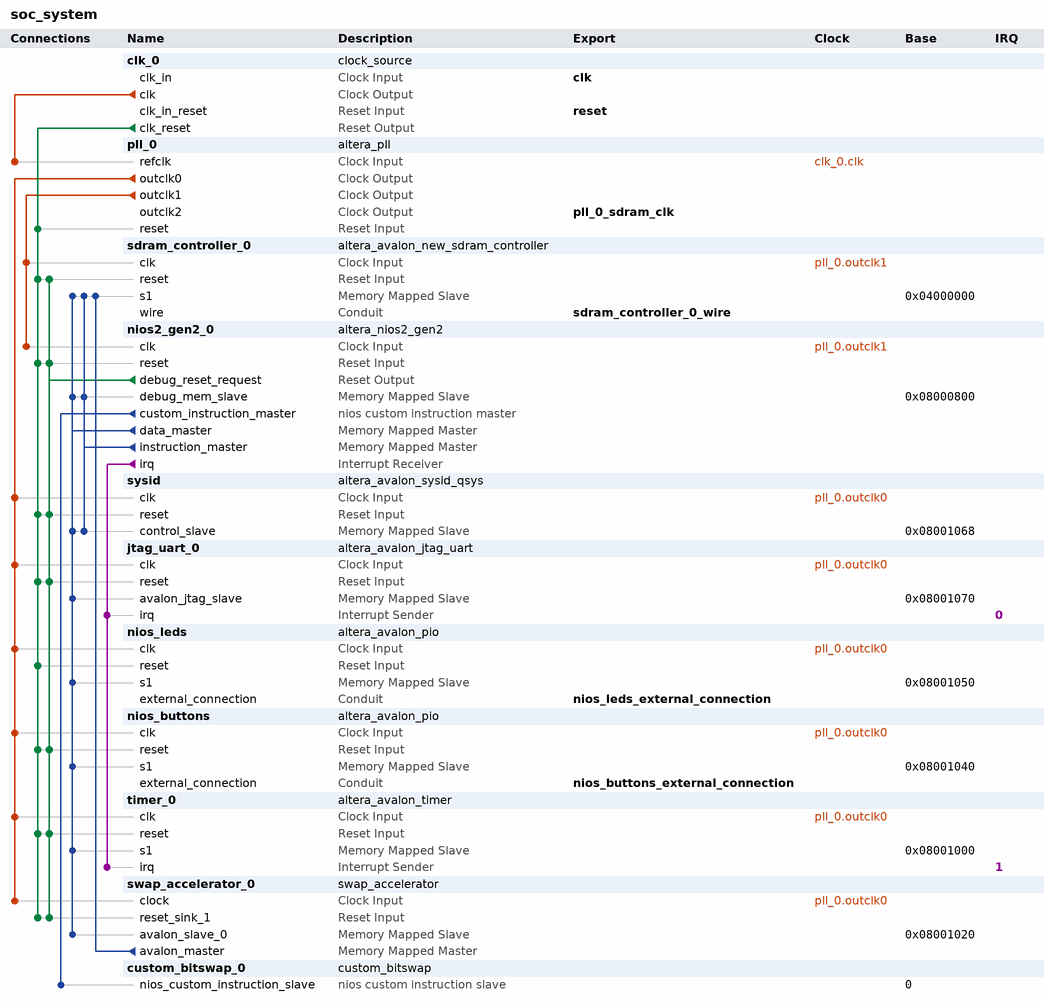
[diagram p0: system contents]
# Platform Designer (Qsys) system soc_system, Cyclone V 5CSEMA5F31C6
# Parameters at their usual value, and those the tool derives, are not listed.
package require -exact qsys 18.1
create_system soc_system
set_project_property DEVICE_FAMILY {Cyclone V}
set_project_property DEVICE 5CSEMA5F31C6

add_instance clk_0 clock_source 18.1
set_instance_parameter_value clk_0 clockFrequency 50000000

add_instance pll_0 altera_pll 18.1
set_instance_parameter_value pll_0 gui_device_speed_grade 1
set_instance_parameter_value pll_0 gui_number_of_clocks 4
set_instance_parameter_value pll_0 gui_operation_mode normal
set_instance_parameter_value pll_0 gui_output_clock_frequency0 50.0
set_instance_parameter_value pll_0 gui_output_clock_frequency1 100.0
set_instance_parameter_value pll_0 gui_output_clock_frequency2 100.0
set_instance_parameter_value pll_0 gui_output_clock_frequency3 300.0
set_instance_parameter_value pll_0 gui_phase_shift2 -3750
set_instance_parameter_value pll_0 gui_pll_mode {Integer-N PLL}
set_instance_parameter_value pll_0 gui_reference_clock_frequency 50.0
set_instance_parameter_value pll_0 gui_use_locked false

add_instance sdram_controller_0 altera_avalon_new_sdram_controller 18.1
set_instance_parameter_value sdram_controller_0 TAC 5.4
set_instance_parameter_value sdram_controller_0 TRCD 15.0
set_instance_parameter_value sdram_controller_0 TRP 15.0
set_instance_parameter_value sdram_controller_0 casLatency 3
set_instance_parameter_value sdram_controller_0 columnWidth 10
set_instance_parameter_value sdram_controller_0 dataWidth 16
set_instance_parameter_value sdram_controller_0 generateSimulationModel false
set_instance_parameter_value sdram_controller_0 model single_Micron_MT48LC4M32B2_7_chip
set_instance_parameter_value sdram_controller_0 numberOfBanks 4
set_instance_parameter_value sdram_controller_0 numberOfChipSelects 1
set_instance_parameter_value sdram_controller_0 powerUpDelay 100.0
set_instance_parameter_value sdram_controller_0 refreshPeriod 7.8125
set_instance_parameter_value sdram_controller_0 rowWidth 13

add_instance nios2_gen2_0 altera_nios2_gen2 18.1
set_instance_parameter_value nios2_gen2_0 dcache_size 2048
set_instance_parameter_value nios2_gen2_0 exceptionSlave sdram_controller_0.s1
set_instance_parameter_value nios2_gen2_0 icache_burstType Sequential
set_instance_parameter_value nios2_gen2_0 icache_size 4096
set_instance_parameter_value nios2_gen2_0 impl Fast
set_instance_parameter_value nios2_gen2_0 resetSlave sdram_controller_0.s1

add_instance sysid altera_avalon_sysid_qsys 18.1
set_instance_parameter_value sysid id 0

add_instance jtag_uart_0 altera_avalon_jtag_uart 18.1
set_instance_parameter_value jtag_uart_0 simInteractiveOptions NO_INTERACTIVE_WINDOWS

add_instance nios_leds altera_avalon_pio 18.1
set_instance_parameter_value nios_leds direction Output
set_instance_parameter_value nios_leds width 10

add_instance nios_buttons altera_avalon_pio 18.1
set_instance_parameter_value nios_buttons direction Input
set_instance_parameter_value nios_buttons width 3

add_instance timer_0 altera_avalon_timer 18.1
set_instance_parameter_value timer_0 period 1000
set_instance_parameter_value timer_0 periodUnits MSEC

add_instance swap_accelerator_0 swap_accelerator 1.0

add_instance custom_bitswap_0 custom_bitswap 1.0

# connections
add_connection clk_0.clk pll_0.refclk clock
add_connection pll_0.outclk0 jtag_uart_0.clk clock
add_connection pll_0.outclk0 nios_buttons.clk clock
add_connection pll_0.outclk0 nios_leds.clk clock
add_connection pll_0.outclk0 swap_accelerator_0.clock clock
add_connection pll_0.outclk0 sysid.clk clock
add_connection pll_0.outclk0 timer_0.clk clock
add_connection pll_0.outclk1 nios2_gen2_0.clk clock
add_connection pll_0.outclk1 sdram_controller_0.clk clock
add_connection clk_0.clk_reset jtag_uart_0.reset reset
add_connection clk_0.clk_reset nios2_gen2_0.reset reset
add_connection clk_0.clk_reset nios_buttons.reset reset
add_connection clk_0.clk_reset nios_leds.reset reset
add_connection clk_0.clk_reset pll_0.reset reset
add_connection clk_0.clk_reset sdram_controller_0.reset reset
add_connection clk_0.clk_reset swap_accelerator_0.reset_sink_1 reset
add_connection clk_0.clk_reset sysid.reset reset
add_connection clk_0.clk_reset timer_0.reset reset
add_connection nios2_gen2_0.debug_reset_request jtag_uart_0.reset reset
add_connection nios2_gen2_0.debug_reset_request nios2_gen2_0.reset reset
add_connection nios2_gen2_0.debug_reset_request nios_buttons.reset reset
add_connection nios2_gen2_0.debug_reset_request sdram_controller_0.reset reset
add_connection nios2_gen2_0.debug_reset_request swap_accelerator_0.reset_sink_1 reset
add_connection nios2_gen2_0.debug_reset_request sysid.reset reset
add_connection nios2_gen2_0.debug_reset_request timer_0.reset reset
add_connection nios2_gen2_0.data_master jtag_uart_0.avalon_jtag_slave avalon
set_connection_parameter_value nios2_gen2_0.data_master/jtag_uart_0.avalon_jtag_slave baseAddress 0x08001070
add_connection nios2_gen2_0.data_master nios2_gen2_0.debug_mem_slave avalon
set_connection_parameter_value nios2_gen2_0.data_master/nios2_gen2_0.debug_mem_slave baseAddress 0x08000800
add_connection nios2_gen2_0.data_master nios_buttons.s1 avalon
set_connection_parameter_value nios2_gen2_0.data_master/nios_buttons.s1 baseAddress 0x08001040
add_connection nios2_gen2_0.data_master nios_leds.s1 avalon
set_connection_parameter_value nios2_gen2_0.data_master/nios_leds.s1 baseAddress 0x08001050
add_connection nios2_gen2_0.data_master sdram_controller_0.s1 avalon
set_connection_parameter_value nios2_gen2_0.data_master/sdram_controller_0.s1 baseAddress 0x04000000
add_connection nios2_gen2_0.data_master swap_accelerator_0.avalon_slave_0 avalon
set_connection_parameter_value nios2_gen2_0.data_master/swap_accelerator_0.avalon_slave_0 baseAddress 0x08001020
add_connection nios2_gen2_0.data_master sysid.control_slave avalon
set_connection_parameter_value nios2_gen2_0.data_master/sysid.control_slave baseAddress 0x08001068
add_connection nios2_gen2_0.data_master timer_0.s1 avalon
set_connection_parameter_value nios2_gen2_0.data_master/timer_0.s1 baseAddress 0x08001000
add_connection nios2_gen2_0.instruction_master nios2_gen2_0.debug_mem_slave avalon
set_connection_parameter_value nios2_gen2_0.instruction_master/nios2_gen2_0.debug_mem_slave baseAddress 0x08000800
add_connection nios2_gen2_0.instruction_master sdram_controller_0.s1 avalon
set_connection_parameter_value nios2_gen2_0.instruction_master/sdram_controller_0.s1 baseAddress 0x04000000
add_connection nios2_gen2_0.instruction_master sysid.control_slave avalon
set_connection_parameter_value nios2_gen2_0.instruction_master/sysid.control_slave baseAddress 0x08001068
add_connection swap_accelerator_0.avalon_master sdram_controller_0.s1 avalon
set_connection_parameter_value swap_accelerator_0.avalon_master/sdram_controller_0.s1 baseAddress 0x04000000
add_connection nios2_gen2_0.irq jtag_uart_0.irq interrupt
set_connection_parameter_value nios2_gen2_0.irq/jtag_uart_0.irq irqNumber 0
add_connection nios2_gen2_0.irq timer_0.irq interrupt
set_connection_parameter_value nios2_gen2_0.irq/timer_0.irq irqNumber 1
add_connection nios2_gen2_0.custom_instruction_master custom_bitswap_0.nios_custom_instruction_slave nios_custom_instruction
set_connection_parameter_value nios2_gen2_0.custom_instruction_master/custom_bitswap_0.nios_custom_instruction_slave CIName custom_bitswap_0
set_connection_parameter_value nios2_gen2_0.custom_instruction_master/custom_bitswap_0.nios_custom_instruction_slave baseAddress 0

# exported interfaces
add_interface clk clock sink
set_interface_property clk EXPORT_OF clk_0.clk_in
add_interface nios_buttons_external_connection conduit end
set_interface_property nios_buttons_external_connection EXPORT_OF nios_buttons.external_connection
add_interface nios_leds_external_connection conduit end
set_interface_property nios_leds_external_connection EXPORT_OF nios_leds.external_connection
add_interface pll_0_sdram_clk clock source
set_interface_property pll_0_sdram_clk EXPORT_OF pll_0.outclk2
add_interface reset reset sink
set_interface_property reset EXPORT_OF clk_0.clk_in_reset
add_interface sdram_controller_0_wire conduit end
set_interface_property sdram_controller_0_wire EXPORT_OF sdram_controller_0.wire

set_interconnect_requirement {$system} qsys_mm.clockCrossingAdapter HANDSHAKE
set_interconnect_requirement {$system} qsys_mm.enableEccProtection FALSE
set_interconnect_requirement {$system} qsys_mm.insertDefaultSlave FALSE
set_interconnect_requirement {$system} qsys_mm.maxAdditionalLatency 1

save_system soc_system.qsys
